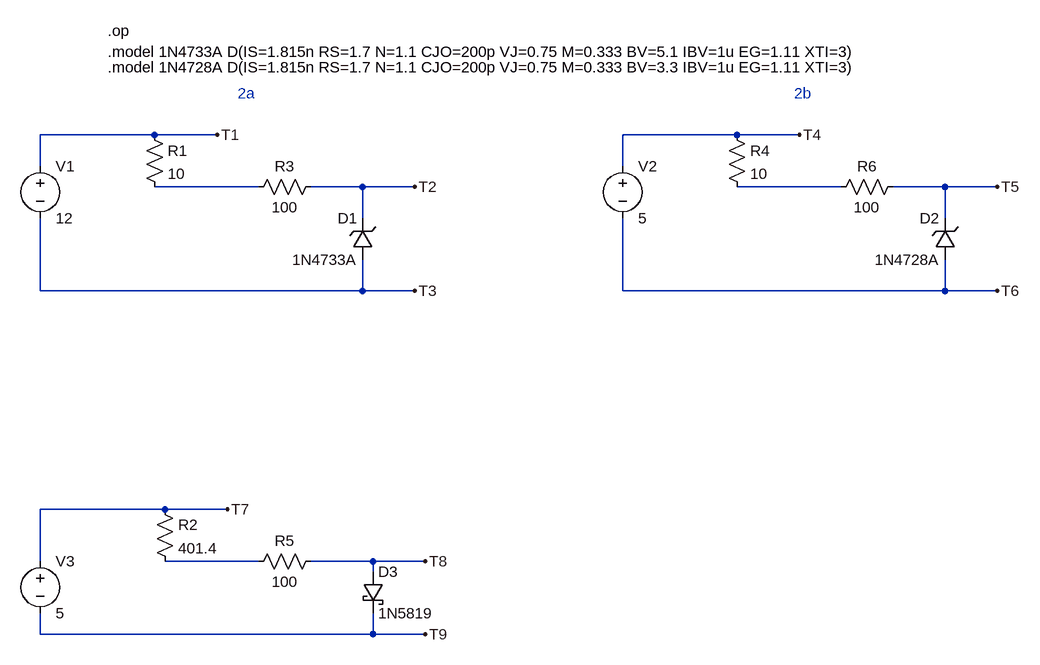
[diagram p0: schematic Draft1.asc]
Draft1.asc, the LTspice schematic file:
Version 4.1
SHEET 1 1640 860
WIRE -16 32 -192 32
WIRE 80 32 -16 32
WIRE 880 32 704 32
WIRE 976 32 880 32
WIRE -192 80 -192 32
WIRE 704 80 704 32
WIRE 144 112 -16 112
WIRE 304 112 224 112
WIRE 384 112 304 112
WIRE 1040 112 880 112
WIRE 1200 112 1120 112
WIRE 1280 112 1200 112
WIRE 304 160 304 112
WIRE 1200 160 1200 112
WIRE -192 272 -192 160
WIRE 304 272 304 224
WIRE 304 272 -192 272
WIRE 384 272 304 272
WIRE 704 272 704 160
WIRE 1200 272 1200 224
WIRE 1200 272 704 272
WIRE 1280 272 1200 272
WIRE 0 608 -192 608
WIRE 96 608 0 608
WIRE -192 688 -192 608
WIRE 144 688 0 688
WIRE 320 688 224 688
WIRE 400 688 320 688
WIRE 320 704 320 688
WIRE -192 800 -192 768
WIRE 320 800 320 768
WIRE 320 800 -192 800
WIRE 400 800 320 800
FLAG 80 32 T1
FLAG 384 112 T2
FLAG 384 272 T3
FLAG 976 32 T4
FLAG 1280 112 T5
FLAG 1280 272 T6
FLAG 96 608 T7
FLAG 400 688 T8
FLAG 400 800 T9
SYMBOL res -32 16 R0
SYMATTR InstName R1
SYMATTR Value 10
SYMBOL res 240 96 R90
WINDOW 0 0 56 VBottom 2
WINDOW 3 32 56 VTop 2
SYMATTR InstName R3
SYMATTR Value 100
SYMBOL voltage -192 64 R0
WINDOW 123 0 0 Left 0
WINDOW 39 0 0 Left 0
SYMATTR InstName V1
SYMATTR Value 12
SYMBOL res 864 16 R0
SYMATTR InstName R4
SYMATTR Value 10
SYMBOL res 1136 96 R90
WINDOW 0 0 56 VBottom 2
WINDOW 3 32 56 VTop 2
SYMATTR InstName R6
SYMATTR Value 100
SYMBOL voltage 704 64 R0
WINDOW 123 0 0 Left 0
WINDOW 39 0 0 Left 0
SYMATTR InstName V2
SYMATTR Value 5
SYMBOL zener 1216 224 R180
WINDOW 0 24 64 Left 2
WINDOW 3 24 0 Left 2
SYMATTR InstName D2
SYMATTR Value 1N4728A
SYMBOL zener 320 224 R180
WINDOW 0 24 64 Left 2
WINDOW 3 24 0 Left 2
SYMATTR InstName D1
SYMATTR Value 1N4733A
SYMBOL voltage -192 672 R0
SYMATTR InstName V3
SYMATTR Value 5
SYMBOL res -16 592 R0
SYMATTR InstName R2
SYMATTR Value 401.4
SYMBOL res 240 672 R90
WINDOW 0 0 56 VBottom 2
WINDOW 3 32 56 VTop 2
SYMATTR InstName R5
SYMATTR Value 100
SYMBOL schottky 304 704 R0
SYMATTR InstName D3
SYMATTR Value 1N5819
TEXT 112 -32 Left 2 ;2a
TEXT 968 -32 Left 2 ;2b
TEXT -88 -128 Left 2 !.op
TEXT -88 -96 Left 2 !.model 1N4733A D(IS=1.815n RS=1.7 N=1.1 CJO=200p VJ=0.75 M=0.333 BV=5.1 IBV=1u EG=1.11 XTI=3)
TEXT -88 -72 Left 2 !.model 1N4728A D(IS=1.815n RS=1.7 N=1.1 CJO=200p VJ=0.75 M=0.333 BV=3.3 IBV=1u EG=1.11 XTI=3)

The netlist it stands for:
* Draft1.asc
R1 T1 N001 10
R3 T2 N001 100
V1 T1 T3 12
R4 T4 N002 10
R6 T5 N002 100
V2 T4 T6 5
D2 T6 T5 1N4728A
D1 T3 T2 1N4733A
V3 T7 T9 5
R2 T7 N003 401.4
R5 T8 N003 100
D3 T8 T9 1N5819
.model D D
.lib standard.dio
* 2a
* 2b
.op
.model 1N4733A D(IS=1.815n RS=1.7 N=1.1 CJO=200p VJ=0.75 M=0.333 BV=5.1 IBV=1u EG=1.11 XTI=3)
.model 1N4728A D(IS=1.815n RS=1.7 N=1.1 CJO=200p VJ=0.75 M=0.333 BV=3.3 IBV=1u EG=1.11 XTI=3)
.backanno
.end